# EAGLE design stepped-tone-generator (EAGLE 9.6.2)
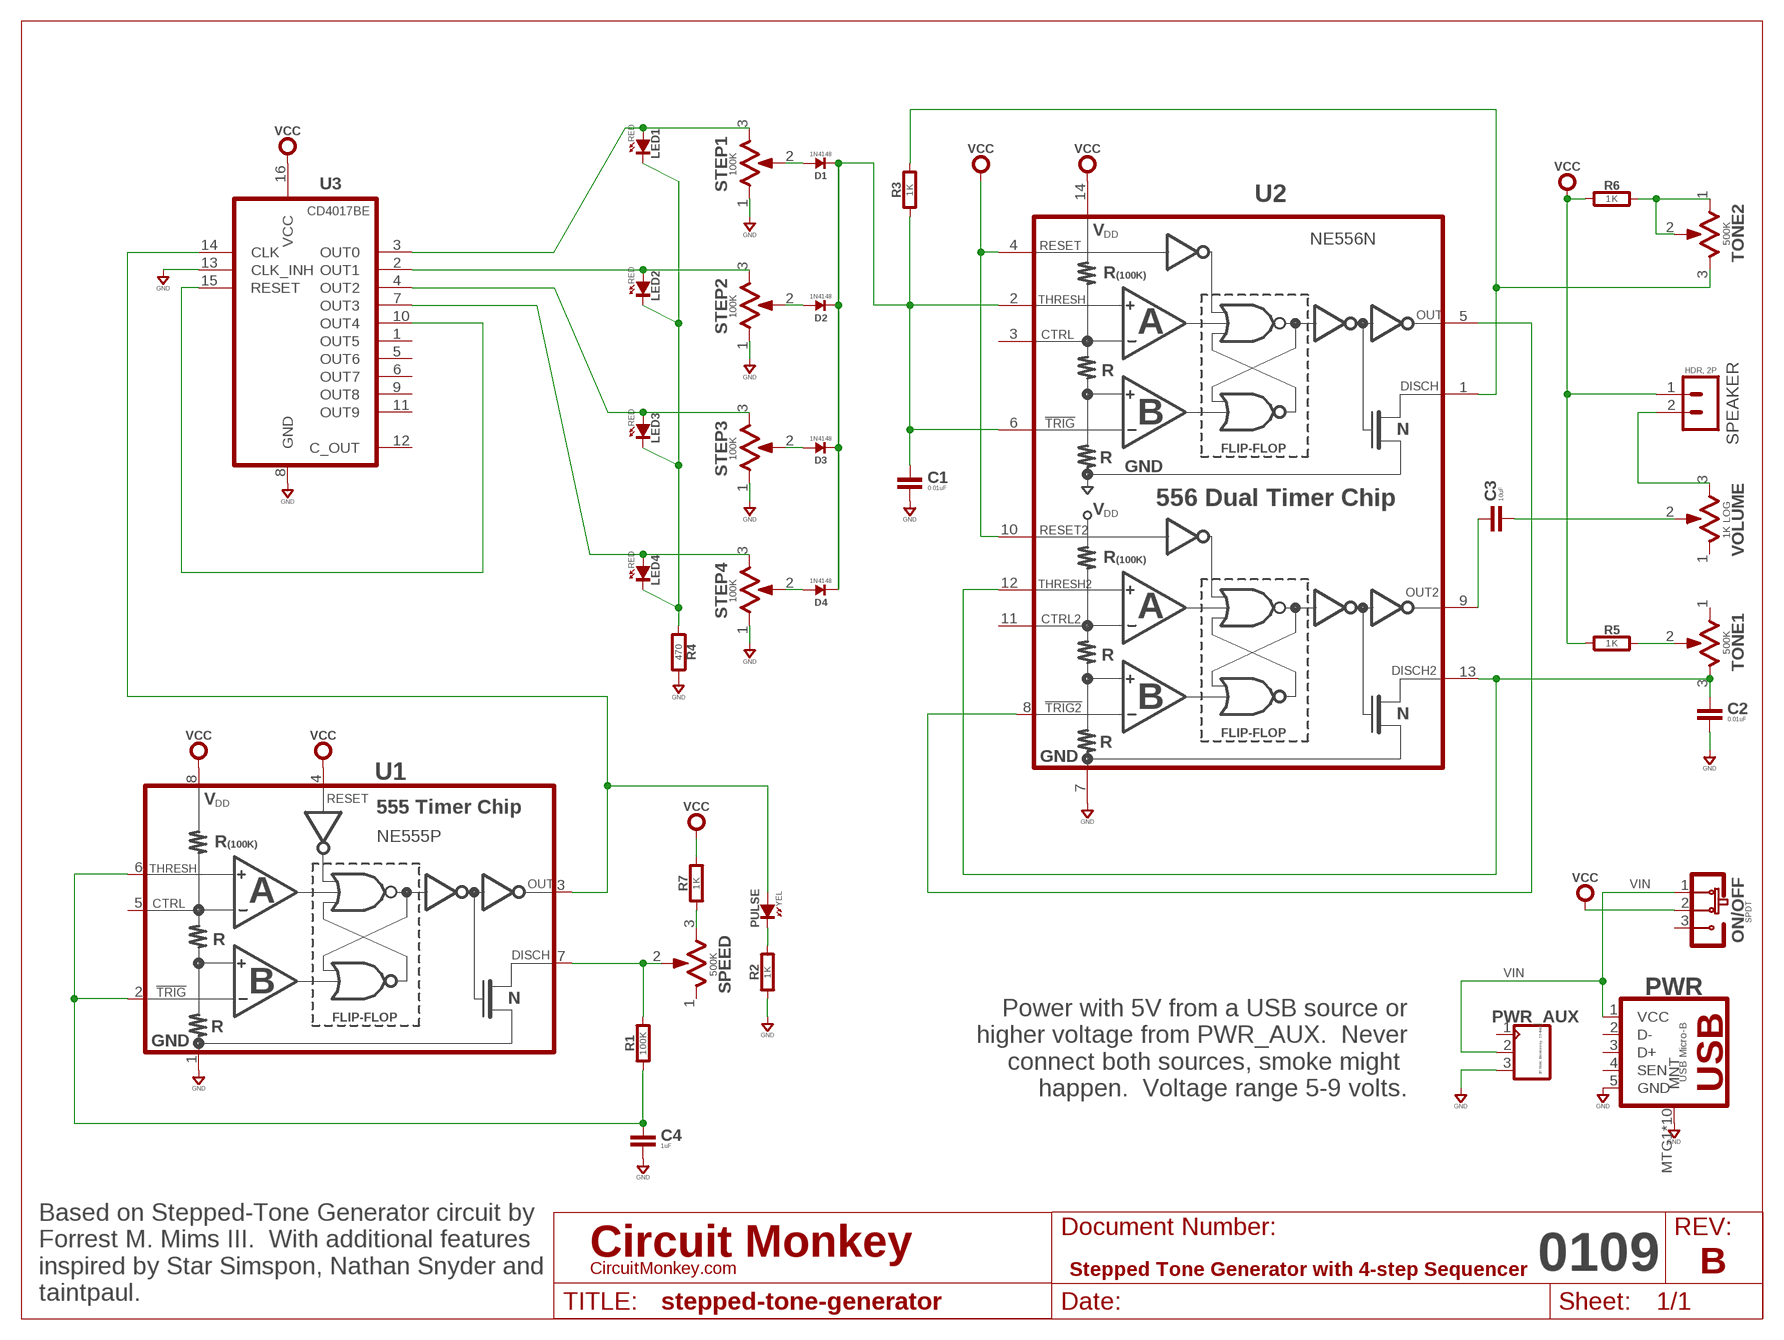
[diagram p0: schematic, sheet 1]
U$1 (LETTER_L-CIRCUITMONKEY): DOCUMENT_NUMBER: Stepped Tone Generator with 4-step Sequencer; REV: B

## Parts
C1  0.01uF  CAPACITORTHD_5MM  [CAP_CER_THD_5MM]
C2  0.01uF  CAPACITORTHD_5MM  [CAP_CER_THD_5MM]
C3  10uF  CAPACITORTHD_5MM  [CAP_CER_THD_5MM]
C4  1uF  CAPACITORTHD_5MM  [CAP_CER_THD_5MM]
D1  1N4148  DIODE-1N4148-THD  [DO-35(THD)]
D2  1N4148  DIODE-1N4148-THD  [DO-35(THD)]
D3  1N4148  DIODE-1N4148-THD  [DO-35(THD)]
D4  1N4148  DIODE-1N4148-THD  [DO-35(THD)]
LED1  RED  THD3MM  [THD_3MM]
LED2  RED  THD3MM  [THD_3MM]
LED3  RED  THD3MM  [THD_3MM]
LED4  RED  THD3MM  [THD_3MM]
ON/OFF  SPDT  TOGGLEMTS-102  [MTS-102]
PULSE  YEL  THD3MM  [THD_3MM]
PWR  USB Micro-B  USB-B-MICRO-SMTJAE-DX4R005  [JAE-DX4R005]
PWR_AUX  3P, Male, Breakaway, 2.54mm  CON_03X1-2.54MM-THD-VT  [MA03X1-VT-THD]
R1  100K  RESISTORTHD_0.25_WATT  [R_THD_0.25W]
R2  1K  RESISTORTHD_0.25_WATT  [R_THD_0.25W]
R3  1K  RESISTORTHD_0.25_WATT  [R_THD_0.25W]
R4  470  RESISTORTHD_0.25_WATT  [R_THD_0.25W]
R5  1K  RESISTORTHD_0.25_WATT  [R_THD_0.25W]
R6  1K  RESISTORTHD_0.25_WATT  [R_THD_0.25W]
R7  1K  RESISTORTHD_0.25_WATT  [R_THD_0.25W]
SPEAKER  HDR, 2P  MA02-1VT  [MA02-1-FAT]
SPEED  500K  POTRK09?113  [ALPS_RK09D113]
STEP1  100K  POTRK09?113  [ALPS_RK09D113]
STEP2  100K  POTRK09?113  [ALPS_RK09D113]
STEP3  100K  POTRK09?113  [ALPS_RK09D113]
STEP4  100K  POTRK09?113  [ALPS_RK09D113]
TONE1  500K  POTRK09?113  [ALPS_RK09D113]
TONE2  500K  POTRK09?113  [ALPS_RK09D113]
U1  NE555P  555PDIP  [DIP-08]
U2  NE556N  556PDIP  [DIP-14]
U3  CD4017BE  CD4017PDIP  [DIP-16]
VOLUME  1K LOG  POTRK09?113  [ALPS_RK09D113]

## Nets
GND: C1.2 C2.2 C4.2 PWR.5(GND) PWR.MTG1(MNT) PWR.MTG2(MNT) PWR.MTG3(MNT) PWR.MTG4(MNT) PWR.MTG5(MNT) PWR.MTG6(MNT) PWR.MTG7(MNT) PWR.MTG8(MNT) PWR.MTG9(MNT) PWR.MTG10(MNT) PWR_AUX.3 R2.1 R4.1 STEP1.1 STEP2.1 STEP3.1 STEP4.1 U1.1(GND) U2.7(GND) U3.8(GND) U3.13(CLK_INH)
N$1: PULSE.A U1.3(OUTPUT) U3.14(CLK)
N$2: U3.10(OUT4) U3.15(RESET)
N$3: LED1.A STEP1.3 U3.3(OUT0)
N$4: LED2.A STEP2.3 U3.2(OUT1)
N$5: LED3.A STEP3.3 U3.4(OUT2)
N$6: LED4.A STEP4.3 U3.7(OUT3)
N$7: R5.2 TONE1.2
N$8: R3.2 TONE2.3 U2.1(DISCHARGE)
N$9: C3.1 U2.9(OUTPUT2)
N$10: C2.1 TONE1.3 U2.12(THRESHOLD2) U2.13(DISCHARGE2)
N$11: U2.5(OUTPUT) U2.8(TRIGGER2#)
N$12: C4.1 R1.1 U1.2(TRIGGER#) U1.6(THRESHOLD)
N$13: LED1.K(C) LED2.K(C) LED3.K(C) LED4.K(C) R4.2
N$14: R1.2 SPEED.2 U1.7(DISCHARGE)
N$15: PULSE.K(C) R2.2
N$16: D1.A STEP1.2
N$17: D2.A STEP2.2
N$18: D3.A STEP3.2
N$19: D4.A STEP4.2
N$20: C1.1 D1.K D2.K D3.K D4.K R3.1 U2.2(THRESHOLD) U2.6(TRIGGER#)
N$21: C3.2 VOLUME.2
N$22: R7.1 SPEED.3
N$23: R6.2 TONE2.1 TONE2.2
N$24: SPEAKER.2 VOLUME.3
VCC: ON/OFF.2 R5.1 R6.1 R7.2 SPEAKER.1 U1.4(RESET#) U1.8(VDD) U2.4(RESET#) U2.10(RESET2) U2.14(VDD) U3.16(VCC)
VIN: ON/OFF.1 PWR.1(VCC) PWR_AUX.2
Unconnected: ON/OFF.3 PWR.2(D-) PWR.3(D+) PWR.4(SEN) PWR_AUX.1 SPEED.1 TONE1.1 U1.5(CONTROL) U2.3(CONTROL) U2.11(CONTROL2#) U3.1(OUT5) U3.5(OUT6) U3.6(OUT7) U3.9(OUT8) U3.11(OUT9) U3.12(C_OUT) VOLUME.1

## Notes on the sheet
- Power with 5V from a USB source or
  higher voltage from PWR_AUX.  Never
  connect both sources, smoke might 
  happen.  Voltage range 5-9 volts.
- 0109
- Based on Stepped-Tone Generator circuit by
  Forrest M. Mims III.  With additional features
  inspired by Star Simspon, Nathan Snyder and 
  taintpaul.

## Power pins joined to a net without a drawn wire
GND: SPEED.MT1A(GND) SPEED.MT1B(GND) SPEED.MT1C(GND) SPEED.MT2A(GND) SPEED.MT2B(GND) SPEED.MT2C(GND) STEP1.MT1A(GND) STEP1.MT1B(GND) STEP1.MT1C(GND) STEP1.MT2A(GND) STEP1.MT2B(GND) STEP1.MT2C(GND) STEP2.MT1A(GND) STEP2.MT1B(GND) STEP2.MT1C(GND) STEP2.MT2A(GND) STEP2.MT2B(GND) STEP2.MT2C(GND) STEP3.MT1A(GND) STEP3.MT1B(GND) STEP3.MT1C(GND) STEP3.MT2A(GND) STEP3.MT2B(GND) STEP3.MT2C(GND) STEP4.MT1A(GND) STEP4.MT1B(GND) STEP4.MT1C(GND) STEP4.MT2A(GND) STEP4.MT2B(GND) STEP4.MT2C(GND) TONE1.MT1A(GND) TONE1.MT1B(GND) TONE1.MT1C(GND) TONE1.MT2A(GND) TONE1.MT2B(GND) TONE1.MT2C(GND) TONE2.MT1A(GND) TONE2.MT1B(GND) TONE2.MT1C(GND) TONE2.MT2A(GND) TONE2.MT2B(GND) TONE2.MT2C(GND) VOLUME.MT1A(GND) VOLUME.MT1B(GND) VOLUME.MT1C(GND) VOLUME.MT2A(GND) VOLUME.MT2B(GND) VOLUME.MT2C(GND)

## Library data of the parts
C1 C2 = rlc:CAPACITOR: Capacitor; MFR: Tayda; MPN: A-550
C3 C4 = rlc:CAPACITOR: Capacitor; MFR: Tayda; MPN: A-550; VALUE: 0.01uF
D1-D4 = diodes:DIODE-: Diode; COST: 0.02; MFR: Tayda; MPN: A-157
LED1-LED4 PULSE = led:THD: THD LED
ON/OFF = switch-thd:TOGGLE: Toggle Switch; MFR: Tayda; MPN: A-4567
PWR = con-usb:USB-B-MICRO-SMT: USB Micro - B-style; MFR: JAE; MPN: DX4R005JJ2R1800; OC_MOUSER: https://www.mouser.com/ProductDetail/DX4R005JJ2R1800
PWR_AUX = con-headers:CON_03X1: Header, 3-pin, single row
R1-R7 = rlc:RESISTOR: Resistor
SPEAKER = con-headers:MA02-1: Header, 2-pin
SPEED STEP1-STEP4 TONE1 TONE2 VOLUME = rlc:POT: Potentiometer with solder mounts; MFR: Alps; MOUSER: https://www.mouser.com/ProductDetail/688-RK09D1130C1B; MPN: RK09D1130C1B; VALUE: 10K
U1 = logic:555: Timer Chip; COST: 0.15; MFR: Tayda; MPN: A-249
U2 = logic:556: 556 Dual Timer; COST: 0.35; MFR: Tayda; MPN: A-040; SPICEPREFIX: X
U3 = logic:CD4017: CD4017 Decade Counter; COST: 0.30; MFR: Tayda; MPN: A-020

## Board
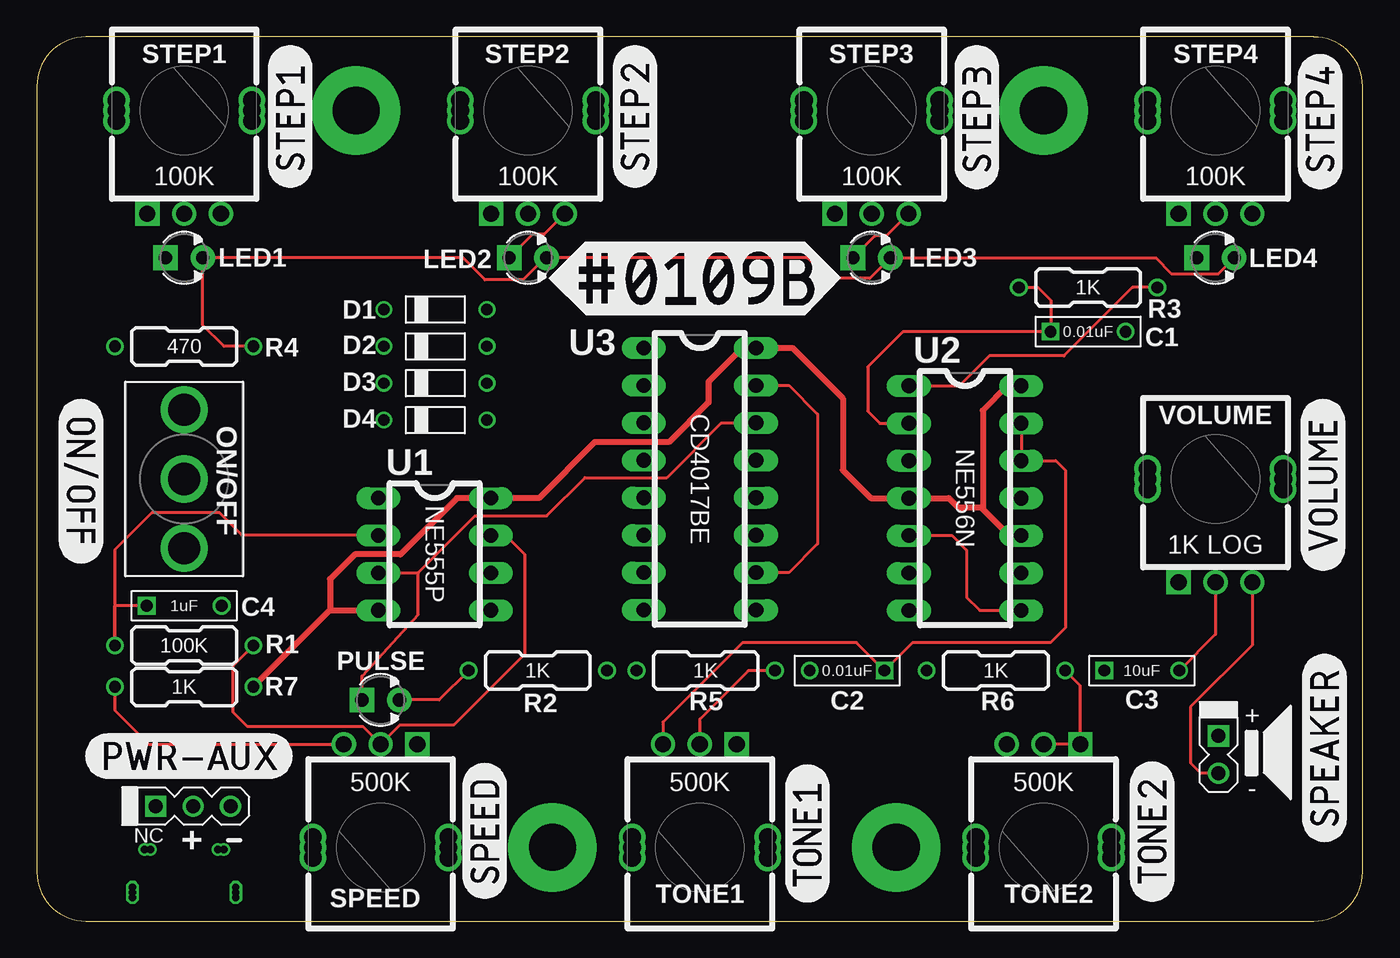
[diagram p1: board, top side]
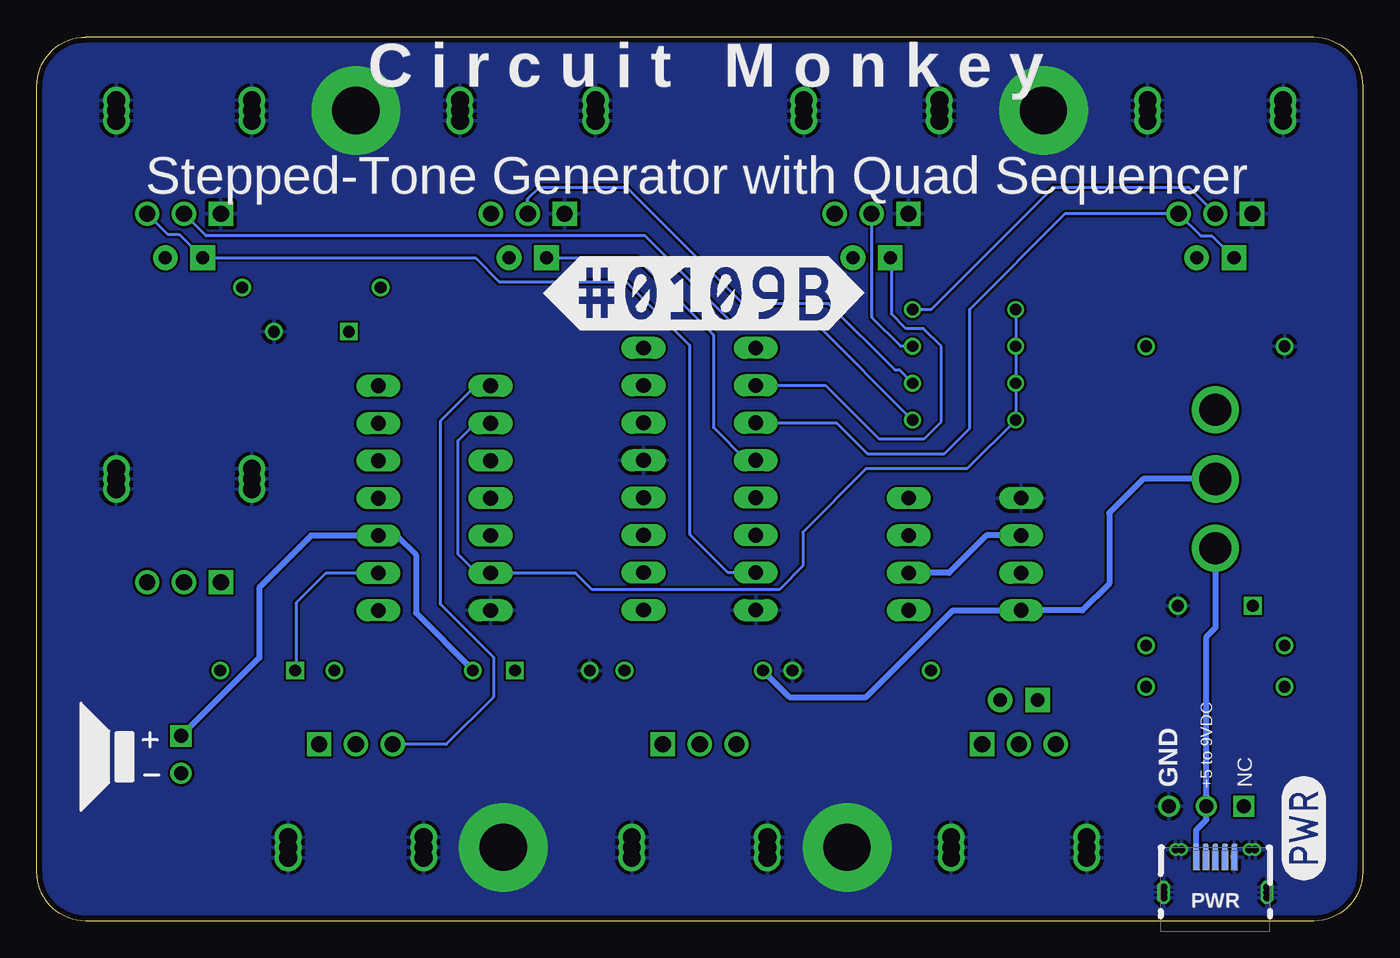
[diagram p2: board, bottom side, seen from below]

Size 89.99 x 60 mm. Coordinates in mm from the lower left corner, seen from the top.
Outline: 3.33,0 86.67,0 arc90 89.99,3.33 89.99,56.66 arc90 86.67,59.98 86.67,60 3.33,60 3.33,59.99 arc90 0,56.66 0,3.33 arc90 3.33,0
Copper layers (1*16): Top 0.0356mm / dielectric 1.5011mm / Bottom 0.0356mm
Design rules "OSH-CircuitMonkey": minimum track width 6mil, minimum drill 13mil, track to track 6mil, track to pad 6mil, pad to pad 6mil, via to via 6mil, smd to smd 6mil, copper to edge 15mil, drill to drill 6mil, minimum pad ring 7mil, minimum via ring 7mil, stop-mask expansion 3mil, vias tented up to drill 13mil, thermal gap 10mil

### Footprints (pad centres in the part's own frame; a part is rotated, then mirrored left to right if it is on the bottom)
CAP_CER_THD_5MM = drill 0.8 square: 1 -2.54,0 | drill 0.8: 2 2.54,0
DO-35(THD) = drill 0.762: A 3.5,0; K -3.5,0
THD_3MM = drill 0.889 pad 1.676 square: A -1.27,0.005 | drill 0.889 pad 1.676: K 1.27,0.005
MTS-102 = drill 2.2: 1 -4.7,0; 2 0,0; 3 4.7,0
JAE-DX4R005 = smd 0.4 x 1.8: 1 -1.3,4.35; 2 -0.65,4.35; 3 0,4.35; 4 0.65,4.35; 5 1.3,4.35 | drill 0.5 octagon: MTG1 -3.5,1.95; MTG2 3.5,1.95; MTG7 -3.5,2.3; MTG8 -3.5,1.6; MTG9 3.5,2.3; MTG10 3.5,1.6 | drill 0.5: MTG3 -2.701,4.85; MTG4 2.701,4.85; MTG5 -2.299,4.85; MTG6 2.299,4.85
MA03X1-VT-THD = drill 0.965 square: 1 0,0 | drill 0.965: 2 2.54,0; 3 5.08,0
R_THD_0.25W = drill 0.8: 1 -4.699,0; 2 4.699,0
MA02-1-FAT = drill 0.965 square: 1 -1.27,0 | drill 0.965: 2 1.27,0
ALPS_RK09D113 = drill 1.1 square: 1 -2.5,-7 | drill 1.1: 2 0,-7; 3 2.5,-7 | drill 1.2: MT1A -4.6,-0.7; MT1B -4.6,0; MT1C -4.6,0.7; MT2A 4.6,-0.7; MT2B 4.6,0; MT2C 4.6,0.7
DIP-08 = drill 1 long: 1 -3.81,3.81; 2 -3.81,1.27; 3 -3.81,-1.27; 4 -3.81,-3.81; 5 3.81,-3.81; 6 3.81,-1.27; 7 3.81,1.27; 8 3.81,3.81
DIP-14 = drill 1 long: 1 -3.81,7.62; 2 -3.81,5.08; 3 -3.81,2.54; 4 -3.81,0; 5 -3.81,-2.54; 6 -3.81,-5.08; 7 -3.81,-7.62; 8 3.81,-7.62; 9 3.81,-5.08; 10 3.81,-2.54; 11 3.81,0; 12 3.81,2.54; 13 3.81,5.08; 14 3.81,7.62
DIP-16 = drill 1 long: 1 -3.81,8.89; 2 -3.81,6.35; 3 -3.81,3.81; 4 -3.81,1.27; 5 -3.81,-1.27; 6 -3.81,-3.81; 7 -3.81,-6.35; 8 -3.81,-8.89; 9 3.81,-8.89; 10 3.81,-6.35; 11 3.81,-3.81; 12 3.81,-1.27; 13 3.81,1.27; 14 3.81,3.81; 15 3.81,6.35; 16 3.81,8.89

### Placement (x,y rotation side)
C1  71.36,40 0 top
C2  55,17 180 top
C3  75,17 0 top
C4  10,21.4 0 top
D1  27.05,41.5 0 top
D2  27.05,39 0 top
D3  27.05,36.5 0 top
D4  27.05,34 0 top
LED1  10,45 0 top
LED2  33.33,45 0 top
LED3  56.67,45 0 top
LED4  80,45 0 top
ON/OFF  10,30 90 top
PULSE  23.33,15 0 top
PWR  10,0 0 bottom
PWR_AUX  8.07,7.8 0 top
R1  10,18.7 0 top
R2  34,17 180 top
R3  71.36,43 0 top
R4  10,39 0 top
R5  45.4,17 0 top
R6  65.1,17 0 top
R7  10,15.9 0 top
SPEAKER  80.2,11.3 270 top
SPEED  23.33,5 180 top
STEP1  10,55 0 top
STEP2  33.33,55 0 top
STEP3  56.67,55 0 top
STEP4  80,55 0 top
TONE1  45,5 180 top
TONE2  68.33,5 180 top
U1  27,24.9 0 top
U2  63,28.7 0 top
U3  45,30 0 top
VOLUME  80,30 0 top

### Tracks (layer width: path | path; a pad name or v marks a point on that pad's centre or on a via)
GND  (via drill 3.2 pad 6)
  other vias: 21.67,55 68.33,55 35,5 58.33,5
  pour Bottom: 0,0 90,0 90,60 0,60
N$1
  Top 0.2: U1.3 23.52,23.63 25.88,23.63 | 25.88,23.63 29.74,27.5 34.6,27.5 37.2,30.1 42.77,30.1 46.48,33.81 U3.14 | PULSE.A 22.06,16.62 25.88,20.79 25.88,23.63
N$2
  Top 0.2: U3.15 51.05,36.35 53,34.4 53,25.6 51.05,23.65 U3.10
N$3
  Bottom 0.2: U3.3 35.71,33.81 33.6,31.7 28.4,31.7 26.7,33.4 26.7,41.5 20.2,48 STEP1.3 11,46.5 10.22,46.5 LED1.A
N$4
  Top 0.2: STEP2.3 34.43,46.6 33.66,46.6 LED2.A
  Bottom 0.2: U3.2 36.45,36.35 32.84,32.74 29.75,32.74 28.6,33.9 28.6,39 29.8,40.2 31,40.2 32,41.2 32,44.94 LED2.A
N$5
  Top 0.2: STEP3.3 57.67,46.5 56.89,46.5 LED3.A
  Bottom 0.2: LED3.A 49.3,45.01 44.07,39.78 44.07,33.49 41.85,31.27 U3.4
N$6
  Bottom 0.2: STEP4.3 81.1,46.6 80.33,46.6 LED4.A 60.2,45 58.6,43.4 50,43.4 45.69,39.09 45.69,26.25 43.09,23.65 U3.7
N$7
  Top 0.2: R5.2 48.3,17 45,13.7 TONE1.2
N$8
  Top 0.2: R3.2 74.37,43 69.72,38.35 64.65,38.35 62.62,36.32 U2.1
  Bottom 0.2: U2.1 60.22,36.32 62.6,33.94 62.6,21.5 59,17.9 59,15.2 62.2,12 TONE2.3
N$9
  Bottom 0.2: U2.9 70.38,23.62 72.4,21.6 72.4,17 C3.1
N$10
  Top 0.2: U2.13 U2.12 69.16,31.24 69.8,30.6 69.8,19.9 68.8,18.9 59.44,18.9 C2.1 55.64,18.9 47.9,18.9 42.5,13.5 TONE1.3
N$11
  Top 0.2: U2.5 62.13,26.16 63.11,25.18 63.11,21.98 64.01,21.08 U2.8
N$12
  Top 0.2: U1.2 13.93,26.17 12.4,27.7 7.8,27.7 5.3,25.2 R1.1 5.3,21.4 C4.1
  Bottom 0.4: U1.2 25.53,26.17 28.07,23.63 U1.6
N$13
  Top 0.2: R4.2 12.7,39 11.27,40.43 LED1.K 28.93,45.01 30.42,43.51 33.01,43.51 34.5,45.01 LED2.K 52.3,45.01 53.69,43.61 56.55,43.61 LED3.K 75.94,45.01 77.04,43.91 80.17,43.91 LED4.K
N$14
  Top 0.2: R1.2 13.3,17.3 13.3,14.2 14.3,13.2 22.13,13.2 SPEED.2 24.63,13.3 28.3,13.3 33.1,18.1 33.1,24.9 31.83,26.17 U1.7
N$15
  Top 0.2: R2.2 27.31,15.01 PULSE.K
N$16
  Bottom 0.2: D1.A 29.3,41.5 21,49.8 11.8,49.8 STEP1.2
N$17
  Bottom 0.2: D2.A 31.35,39 33.3,40.95 33.3,48 STEP2.2
N$18
  Bottom 0.2: D3.A 31.45,37.4 31.75,37.4 36.25,41.9 42.07,41.9 49.97,49.8 55.87,49.8 56.67,49 STEP3.2
N$19
  Bottom 0.2: D4.A 37.05,40.5 42.7,40.5 48.7,46.5 78.5,46.5 STEP4.2
N$20
  Top 0.2: R3.1 67.96,43 68.82,42.14 C1.1 58.8,40 56.4,37.6 56.4,34.6 57.22,33.78 U2.2
  Bottom 0.2: D1.K D2.K D3.K D4.K 26.85,30.7 33.7,30.7 38,26.4 38,24.1 39.6,22.5 52.3,22.5 53.42,23.62 U2.6 60.12,23.62 61.4,24.9 61.4,32.6 60.22,33.78 U2.2
N$21
  Top 0.2: C3.2 80,19.46 VOLUME.2
N$22
  Top 0.2: R7.1 5.3,14.3 7.6,12 SPEED.3
N$23
  Top 0.2: R6.2 70.8,16 70.8,12 TONE2.1 TONE2.2
N$24
  Top 0.2: SPEAKER.2 79,10.03 78.3,10.73 78.3,14.53 82.5,18.73 VOLUME.3
VCC
  Top 0.4: U2.14 65.88,36.32 64.2,34.64 64.2,27.96 66,26.16 U2.10 | R7.2 19.89,21.09
  Top 0.406: U2.10 66.01,26.16 64.11,28.06 62.54,28.06 61.9,28.7 U2.4 56.6,28.7 54.7,30.6 54.7,35.47 51.28,38.89 U3.16 47.89,38.89 45.6,36.6 45.6,35.2 42.9,32.5 37.87,32.5 34.08,28.71 U1.8 28.51,28.71 24.69,24.89 21.59,24.89 19.9,23.2 19.9,21.11 19.92,21.09 | 19.89,21.09 19.92,21.09 | 19.92,21.09 U1.4
  Bottom 0.4: SPEAKER.1 74.9,17.87 74.9,22.63 71.37,26.16 U2.10 65.56,26.16 64.25,24.85 64.25,20.91 60.4,17.06 R6.1 | ON/OFF.2 14.9,30 17.2,27.7 17.2,22.9 19.01,21.09 U1.4 27.81,21.09 33.7,15.2 38.9,15.2 R5.1
VIN
  Bottom 0.4: ON/OFF.1 10,19.91 10.61,19.3 PWR_AUX.2 10.61,6.89 11.3,6.2 PWR.1

### Text on the board
tPlace: + / / - | NC | +
bPlace: C i r c u i t M o n k e y | Stepped-Tone Generator with Quad Sequencer | NC | +5 to 9VDC | GND